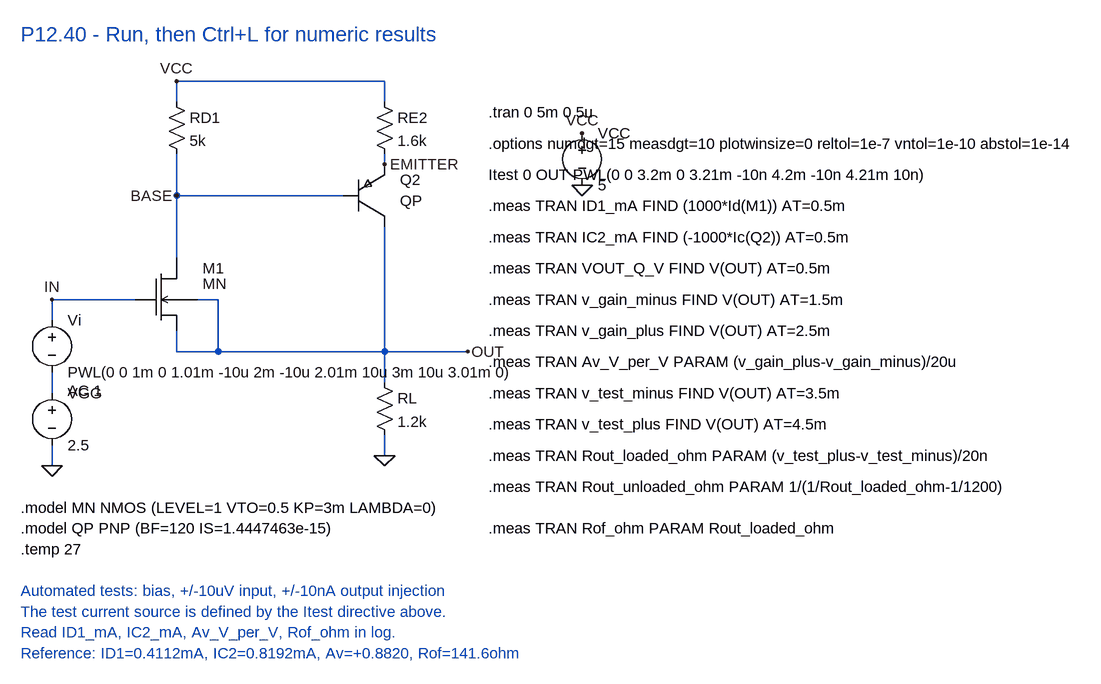
[diagram p0: schematic P12_40_Auto.asc]
P12_40_Auto.asc, the LTspice schematic file:
Version 4
SHEET 1 1600 1200
WIRE 320 96 320 128
WIRE 320 96 640 96
WIRE 640 96 640 128
WIRE 320 208 320 272
WIRE 320 272 320 368
WIRE 320 272 576 272
WIRE 640 208 640 224
WIRE 640 320 640 512
WIRE 320 480 320 512
WIRE 320 512 384 512
WIRE 384 512 640 512
WIRE 352 432 384 432
WIRE 384 432 384 512
WIRE 128 432 256 432
WIRE 128 432 128 464
WIRE 128 544 128 576
WIRE 640 512 768 512
WIRE 640 512 640 560
WIRE 640 640 640 672
WIRE 128 656 128 688
FLAG 320 96 VCC
FLAG 128 432 IN
FLAG 320 272 BASE
FLAG 640 224 EMITTER
FLAG 768 512 OUT
FLAG 640 672 0
FLAG 128 688 0
FLAG 944 176 VCC
FLAG 944 256 0
SYMBOL res 304 112 R0
SYMATTR InstName RD1
SYMATTR Value 5k
SYMBOL res 624 112 R0
SYMATTR InstName RE2
SYMATTR Value 1.6k
SYMBOL P12_PNP 576 224 R0
SYMATTR InstName Q2
SYMATTR Value QP
SYMBOL P12_NMOS 256 368 R0
SYMATTR InstName M1
SYMATTR Value MN
SYMATTR SpiceLine L=1u W=1u
SYMBOL res 624 544 R0
SYMATTR InstName RL
SYMATTR Value 1.2k
SYMBOL voltage 128 448 R0
WINDOW 123 24 124 Left 2
SYMATTR InstName Vi
SYMATTR Value PWL(0 0 1m 0 1.01m -10u 2m -10u 2.01m 10u 3m 10u 3.01m 0)
SYMATTR Value2 AC 1
SYMBOL voltage 128 560 R0
SYMATTR InstName VGG
SYMATTR Value 2.5
SYMBOL voltage 944 160 R0
SYMATTR InstName VCC
SYMATTR Value 5
TEXT 80 24 Left 3 ;P12.40 - Run, then Ctrl+L for numeric results
TEXT 80 752 Left 2 !.model MN NMOS (LEVEL=1 VTO=0.5 KP=3m LAMBDA=0)
TEXT 80 784 Left 2 !.model QP PNP (BF=120 IS=1.4447463e-15)
TEXT 80 816 Left 2 !.temp 27
TEXT 800 144 Left 2 !.tran 0 5m 0 5u
TEXT 800 192 Left 2 !.options numdgt=15 measdgt=10 plotwinsize=0 reltol=1e-7 vntol=1e-10 abstol=1e-14
TEXT 800 240 Left 2 !Itest 0 OUT PWL(0 0 3.2m 0 3.21m -10n 4.2m -10n 4.21m 10n)
TEXT 800 288 Left 2 !.meas TRAN ID1_mA FIND (1000*Id(M1)) AT=0.5m
TEXT 800 336 Left 2 !.meas TRAN IC2_mA FIND (-1000*Ic(Q2)) AT=0.5m
TEXT 800 384 Left 2 !.meas TRAN VOUT_Q_V FIND V(OUT) AT=0.5m
TEXT 800 432 Left 2 !.meas TRAN v_gain_minus FIND V(OUT) AT=1.5m
TEXT 800 480 Left 2 !.meas TRAN v_gain_plus FIND V(OUT) AT=2.5m
TEXT 800 528 Left 2 !.meas TRAN Av_V_per_V PARAM (v_gain_plus-v_gain_minus)/20u
TEXT 800 576 Left 2 !.meas TRAN v_test_minus FIND V(OUT) AT=3.5m
TEXT 800 624 Left 2 !.meas TRAN v_test_plus FIND V(OUT) AT=4.5m
TEXT 800 672 Left 2 !.meas TRAN Rout_loaded_ohm PARAM (v_test_plus-v_test_minus)/20n
TEXT 800 720 Left 2 !.meas TRAN Rout_unloaded_ohm PARAM 1/(1/Rout_loaded_ohm-1/1200)
TEXT 80 880 Left 2 ;Automated tests: bias, +/-10uV input, +/-10nA output injection
TEXT 80 912 Left 2 ;The test current source is defined by the Itest directive above.
TEXT 80 944 Left 2 ;Read ID1_mA, IC2_mA, Av_V_per_V, Rof_ohm in log.
TEXT 80 976 Left 2 ;Reference: ID1=0.4112mA, IC2=0.8192mA, Av=+0.8820, Rof=141.6ohm
TEXT 800 784 Left 2 !.meas TRAN Rof_ohm PARAM Rout_loaded_ohm

The netlist it stands for:
* P12_40_Auto.asc
RD1 VCC BASE 5k
RE2 VCC EMITTER 1.6k
Q2 OUT BASE EMITTER 0 QP
M1 BASE IN OUT OUT MN L=1u W=1u
RL OUT 0 1.2k
Vi IN N001 PWL(0 0 1m 0 1.01m -10u 2m -10u 2.01m 10u 3m 10u 3.01m 0) AC 1
VGG N001 0 2.5
VCC VCC 0 5
.model NPN NPN
.model PNP PNP
.lib standard.bjt
.model NMOS NMOS
.model PMOS PMOS
.lib standard.mos
* P12.40 - Run, then Ctrl+L for numeric results
.model MN NMOS (LEVEL=1 VTO=0.5 KP=3m LAMBDA=0)
.model QP PNP (BF=120 IS=1.4447463e-15)
.temp 27
.tran 0 5m 0 5u
.options numdgt=15 measdgt=10 plotwinsize=0 reltol=1e-7 vntol=1e-10 abstol=1e-14
Itest 0 OUT PWL(0 0 3.2m 0 3.21m -10n 4.2m -10n 4.21m 10n)
.meas TRAN ID1_mA FIND (1000*Id(M1)) AT=0.5m
.meas TRAN IC2_mA FIND (-1000*Ic(Q2)) AT=0.5m
.meas TRAN VOUT_Q_V FIND V(OUT) AT=0.5m
.meas TRAN v_gain_minus FIND V(OUT) AT=1.5m
.meas TRAN v_gain_plus FIND V(OUT) AT=2.5m
.meas TRAN Av_V_per_V PARAM (v_gain_plus-v_gain_minus)/20u
.meas TRAN v_test_minus FIND V(OUT) AT=3.5m
.meas TRAN v_test_plus FIND V(OUT) AT=4.5m
.meas TRAN Rout_loaded_ohm PARAM (v_test_plus-v_test_minus)/20n
.meas TRAN Rout_unloaded_ohm PARAM 1/(1/Rout_loaded_ohm-1/1200)
* Automated tests: bias, +/-10uV input, +/-10nA output injection
* The test current source is defined by the Itest directive above.
* Read ID1_mA, IC2_mA, Av_V_per_V, Rof_ohm in log.
* Reference: ID1=0.4112mA, IC2=0.8192mA, Av=+0.8820, Rof=141.6ohm
.meas TRAN Rof_ohm PARAM Rout_loaded_ohm
.backanno
.end

* Results of the author's LTspice run, read from the files saved beside the schematic
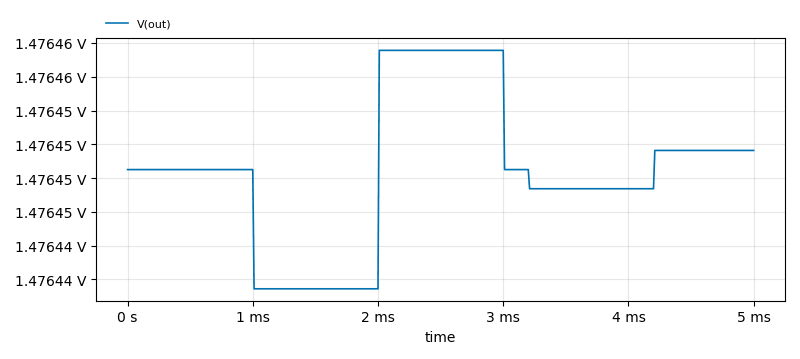
[diagram p1: Transient Analysis of P12_40_Auto.asc, plotted from the saved traces]
* Transient Analysis, 1 run:
*   V(out): min 1.476 V, max 1.476 V, average 1.476 V, rms 1.476 V, last 1.476 V
* From the log:
*   id1_ma: (1000*Id(M1))=0.4111598452 at 0.0005
*   ic2_ma: (-1000*Ic(Q2))=0.8192135958 at 0.0005
*   vout_q_v: V(OUT)=1.476448129 at 0.0005
*   v_gain_minus: V(OUT)=1.476439309 at 0.0015
*   v_gain_plus: V(OUT)=1.476456949 at 0.0025
*   av_v_per_v: (v_gain_plus-v_gain_minus)/20u=0.8819698232
*   v_test_minus: V(OUT)=1.476446713 at 0.0035
*   v_test_plus: V(OUT)=1.476449546 at 0.0045
*   rout_loaded_ohm: (v_test_plus-v_test_minus)/20n=141.63621
*   rout_unloaded_ohm: 1/(1/Rout_loaded_ohm-1/1200)=160.5907662
*   rof_ohm: Rout_loaded_ohm=141.63621